# EAGLE schematic Test2 (EAGLE 8.2.2)
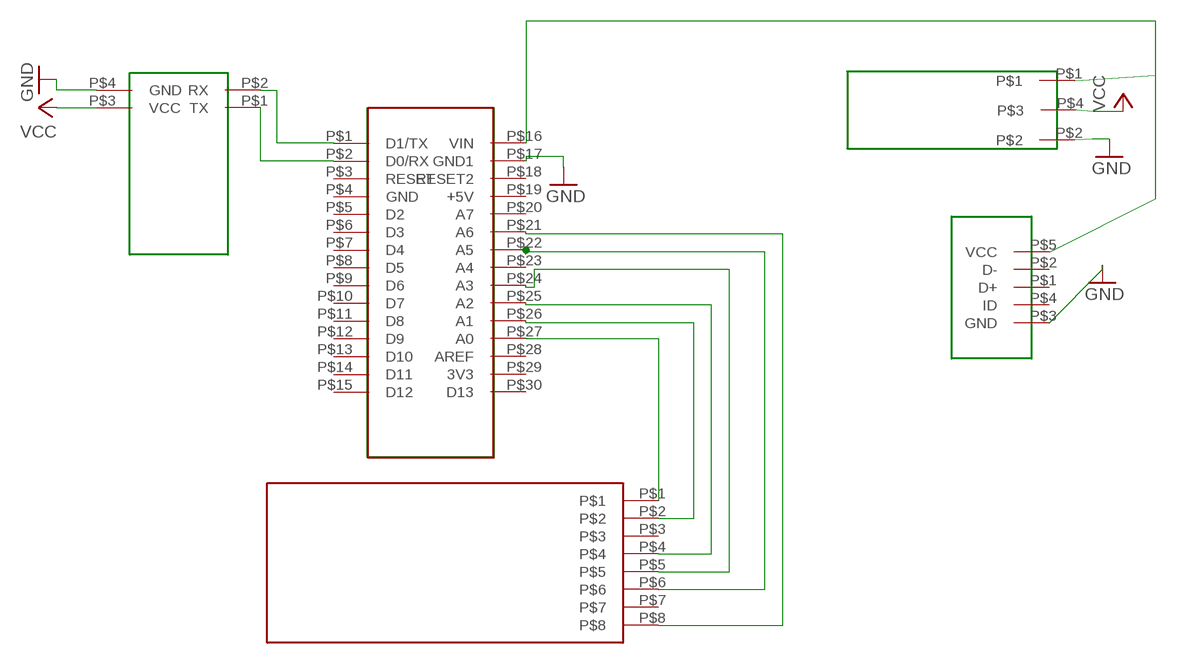
[diagram p0: schematic, sheet 1]

## Parts
U$1  LEDARRAYLEDARRAY  [LEDARRAY]
U$2  ARDUINONANOARDUINONAONO  [ARDUINONANO]
U$5  LMC3V3LMC3V3  [LMC3V3]
U$6  RN41RN41  [RN41]
U$7  USBUSB  [USB]

## Nets
GND: U$2.P$17(GND1) U$5.P$2 U$6.P$4(GND) U$7.P$3(GND)
N$1: U$2.P$2(D0/RX) U$6.P$1(TX)
N$2: U$2.P$1(D1/TX) U$6.P$2(RX)
N$3: U$1.P$6 U$2.P$22(A5)
N$4: U$1.P$1 U$2.P$27(A0)
N$5: U$1.P$2 U$2.P$26(A1)
N$6: U$1.P$4 U$2.P$25(A2)
N$7: U$2.P$16(VIN) U$5.P$1 U$7.P$5(VCC)
N$8: U$1.P$5 U$2.P$24(A3)
N$10: U$1.P$8 U$2.P$21(A6)
VCC: U$5.P$4 U$6.P$3(VCC)
Unconnected: U$1.P$3 U$1.P$7 U$2.P$3(RESET) U$2.P$4(GND) U$2.P$5(D2) U$2.P$6(D3) U$2.P$7(D4) U$2.P$8(D5) U$2.P$9(D6) U$2.P$10(D7) U$2.P$11(D8) U$2.P$12(D9) U$2.P$13(D10) U$2.P$14(D11) U$2.P$15(D12) U$2.P$18(RESET2) U$2.P$19(+5V) U$2.P$20(A7) U$2.P$23(A4) U$2.P$28(AREF) U$2.P$29(3V3) U$2.P$30(D13) U$7.P$1(D+) U$7.P$2(D-) U$7.P$4(ID)

## Library data of the parts
U$1 = clouddemo:LEDARRAY
U$2 = clouddemo:ARDUINONANO; CNT: 0; HEIGHT: 10
U$5 = clouddemo:LMC3V3; CNT: 0; HEIGHT: 25
U$6 = clouddemo:RN41; CNT: 0; HEIGHT: 0.7
U$7 = clouddemo:USB; CNT: 1; HEIGHT: 15.00